# Altium schematic sheet MCU_F2.SchDoc
size A3
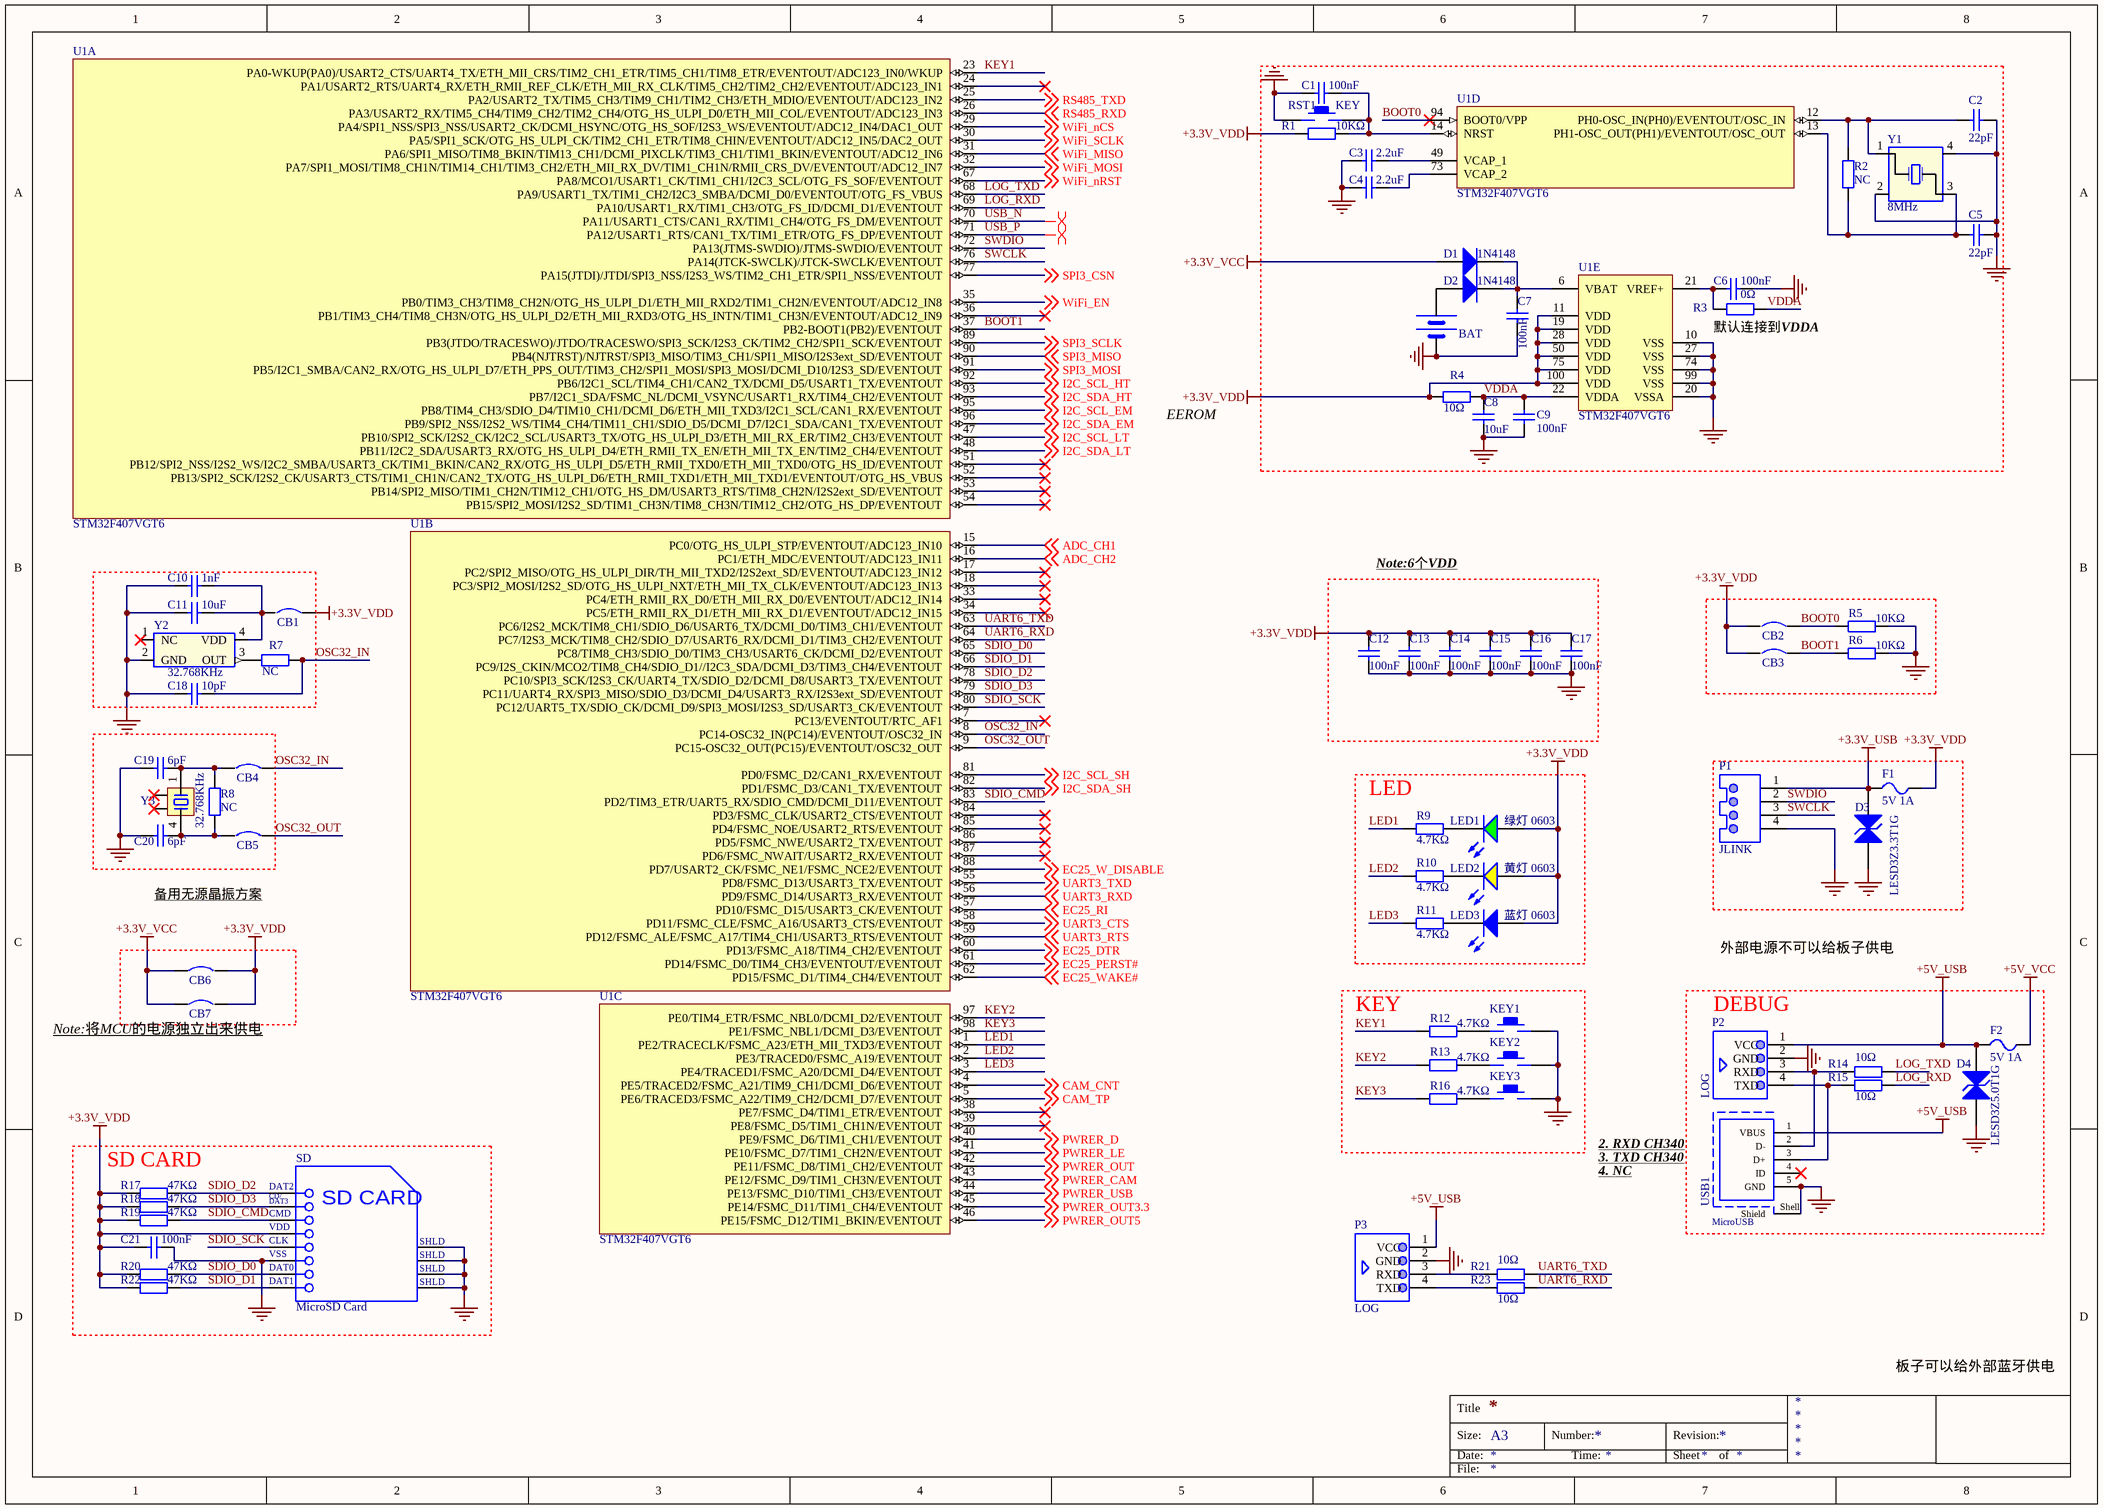
[diagram p0: MCU_F2.SchDoc]

## Parts
BAT  BAT CR1220  [CR1220_B]  (value not drawn)
C1  100nF  [0603_C]
C2  22pF  [0402_C]
C3  2.2uF  [0603_C]
C4  2.2uF  [0603_C]
C5  22pF  [0402_C]
C6  100nF  [0402_C]
C7  100nF  [0402_C]
C8  10uF  [0805_C]
C9  100nF  [0402_C]
C10  1nF  [0402_C]
C11  10uF  [0603_C]
C12  100nF  [0402_C]
C13  100nF  [0402_C]
C14  100nF  [0402_C]
C15  100nF  [0402_C]
C16  100nF  [0402_C]
C17  100nF  [0402_C]
C18  10pF  [0402_C]
C19  6pF  [0402_C]
C20  6pF  [0402_C]
C21  100nF  [0402_C]
CB1  CB  [CW]  (value not drawn)  (no BOM)
CB2  CB  [CW]  (value not drawn)  (no BOM)
CB3  CB  [CW]  (value not drawn)  (no BOM)
CB4  CB  [CW]  (value not drawn)  (no BOM)
CB5  CB  [CW]  (value not drawn)  (no BOM)
CB6  CB  [CW]  (value not drawn)  (no BOM)
CB7  CB  [CW]  (value not drawn)  (no BOM)
D1  1N4148  [SOD-323]
D2  1N4148  [SOD-323]
D3  LESD3Z3.3T1G  [SOD-323]
D4  LESD3Z5.0T1G  [SOD-323]
F1  5V 1A  [FU 0603]
F2  5V 1A  [FU 0603]
KEY1  KEY  [TSW SMD-6*6*5]  (value not drawn)
KEY2  KEY  [TSW SMD-6*6*5]  (value not drawn)
KEY3  KEY  [TSW SMD-6*6*5]  (value not drawn)
LED1  绿灯 0603  [0603_LED_S1]
LED2  黄灯 0603  [0603_LED_S1]
LED3  蓝灯 0603  [0603_LED_S1]
P1  JLINK  [XH2.54-4P]
P2  LOG  [HDR-4P UART]
P3  LOG  [HDR-4P UART]
R1  10KΩ  [0603_R]
R2  NC  [0402_R]
R3  0Ω  [0402_R]
R4  10Ω  [0402_R]
R5  10KΩ  [0402_R]
R6  10KΩ  [0402_R]
R7  NC  [0402_R]
R8  NC  [0402_R]
R9  4.7KΩ  [0603_R]
R10  4.7KΩ  [0603_R]
R11  4.7KΩ  [0603_R]
R12  4.7KΩ  [0603_R]
R13  4.7KΩ  [0603_R]
R14  10Ω  [0402_R]
R15  10Ω  [0402_R]
R16  4.7KΩ  [0603_R]
R17  47KΩ  [0402_R]
R18  47KΩ  [0402_R]
R19  47KΩ  [0402_R]
R20  47KΩ  [0402_R]
R21  10Ω  [0402_R]
R22  47KΩ  [0402_R]
R23  10Ω  [0402_R]
RST1  KEY  [TSW SMD-4*4*1.5]
SD  MicroSD Card  [MOLX-47219-2001-8_V]
U1  STM32F407VGT6  [STM-LQFP100_L]  (parts A,B,C,D,E of 5)
USB1  MicroUSB  [MOLX-47589-0001]
Y1  8MHz  [XTAL-5032-4P]
Y2  32.768KHz  [XTAL-3225-4P]
Y3  32.768KHz  [OSC MC-306]

## Blocks framed on the sheet
默认连接到VDDA: BAT C1-C9 D1 D2 R1-R4 RST1 U1 Y1
Note:6个VDD: C12-C17
LED: LED1-LED3 R9-R11
KEY: KEY1-KEY3 R12 R13 R16
DEBUG: D4 F2 P2 R14 R15 USB1
SD CARD: C21 R17-R20 R22 SD

## Nets
+3.3V_USB: D3.2(K) F1.1 P1.1
+3.3V_VCC: CB6.1 CB7.1 D1.1(A)
+3.3V_VDD: C12.1 C13.1 C14.1 C15.1 C16.1 C17.1 C21.1 CB1.2 CB2.1 CB3.1 CB6.2 CB7.2 F1.2 LED1.A LED2.A LED3.A R1.1 R4.1 R17.1 R18.1 R19.1 R20.1 R22.1 SD.4(VDD) U1.11(VDD) U1.19(VDD) U1.28(VDD) U1.50(VDD) U1.75(VDD) U1.100(VDD)
+5V_USB: D4.2(K) F2.1 P2.1(VCC) P3.1(VCC) USB1.1(VBUS)
+5V_VCC: F2.2
GND: BAT.2(GND) C1.1 C2.2 C3.1 C4.1 C5.2 C6.1 C7.2 C8.1 C9.1 C10.1 C11.1 C12.2 C13.2 C14.2 C15.2 C16.2 C17.2 C18.1 C19.2 C20.2 C21.2 D3.1(A) D4.1(A) KEY1.2 KEY2.2 KEY3.2 P1.4 P2.2(GND) P3.2(GND) R5.2 R6.2 RST1.1 SD.6(VSS) SD.9(SHLD) SD.10(SHLD) SD.11(SHLD) SD.12(SHLD) U1.10(VSS) U1.20(VSSA) U1.27(VSS) U1.74(VSS) U1.99(VSS) USB1.5(GND) USB1.Shell(Shield) Y1.2 Y1.4 Y2.2(GND)
ADC_CH1: U1.15(PC0/OTG_HS_ULPI_STP/EVENTOUT/ADC123_IN10) ; off-sheet ADC_CH1
ADC_CH2: U1.16(PC1/ETH_MDC/EVENTOUT/ADC123_IN11) ; off-sheet ADC_CH2
BOOT0: CB2.2 R5.1 U1.94(BOOT0/VPP)
BOOT1: CB3.2 R6.1 U1.37(PB2-BOOT1(PB2)/EVENTOUT)
CAM_CNT: U1.4(PE5/TRACED2/FSMC_A21/TIM9_CH1/DCMI_D6/EVENTOUT) ; off-sheet CAM_CNT
CAM_TP: U1.5(PE6/TRACED3/FSMC_A22/TIM9_CH2/DCMI_D7/EVENTOUT) ; off-sheet CAM_TP
EC25_DTR: U1.60(PD13/FSMC_A18/TIM4_CH2/EVENTOUT) ; off-sheet EC25_DTR
EC25_PERST#: U1.61(PD14/FSMC_D0/TIM4_CH3/EVENTOUT/EVENTOUT) ; off-sheet EC25_PERST#
EC25_RI: U1.57(PD10/FSMC_D15/USART3_CK/EVENTOUT) ; off-sheet EC25_RI
EC25_W_DISABLE: U1.88(PD7/USART2_CK/FSMC_NE1/FSMC_NCE2/EVENTOUT) ; off-sheet EC25_W_DISABLE
EC25_WAKE#: U1.62(PD15/FSMC_D1/TIM4_CH4/EVENTOUT) ; off-sheet EC25_WAKE#
I2C_SCL_EM: U1.95(PB8/TIM4_CH3/SDIO_D4/TIM10_CH1/DCMI_D6/ETH_MII_TXD3/I2C1_SCL/CAN1_RX/EVENTOUT) ; off-sheet I2C_SCL_EM
I2C_SCL_HT: U1.92(PB6/I2C1_SCL/TIM4_CH1/CAN2_TX/DCMI_D5/USART1_TX/EVENTOUT) ; off-sheet I2C_SCL_HT
I2C_SCL_LT: U1.47(PB10/SPI2_SCK/I2S2_CK/I2C2_SCL/USART3_TX/OTG_HS_ULPI_D3/ETH_MII_RX_ER/TIM2_CH3/EVENTOUT) ; off-sheet I2C_SCL_LT
I2C_SCL_SH: U1.81(PD0/FSMC_D2/CAN1_RX/EVENTOUT) ; off-sheet I2C_SCL_SH
I2C_SDA_EM: U1.96(PB9/SPI2_NSS/I2S2_WS/TIM4_CH4/TIM11_CH1/SDIO_D5/DCMI_D7/I2C1_SDA/CAN1_TX/EVENTOUT) ; off-sheet I2C_SDA_EM
I2C_SDA_HT: U1.93(PB7/I2C1_SDA/FSMC_NL/DCMI_VSYNC/USART1_RX/TIM4_CH2/EVENTOUT) ; off-sheet I2C_SDA_HT
I2C_SDA_LT: U1.48(PB11/I2C2_SDA/USART3_RX/OTG_HS_ULPI_D4/ETH_RMII_TX_EN/ETH_MII_TX_EN/TIM2_CH4/EVENTOUT) ; off-sheet I2C_SDA_LT
I2C_SDA_SH: U1.82(PD1/FSMC_D3/CAN1_TX/EVENTOUT) ; off-sheet I2C_SDA_SH
KEY1: R12.1 U1.23(PA0-WKUP(PA0)/USART2_CTS/UART4_TX/ETH_MII_CRS/TIM2_CH1_ETR/TIM5_CH1/TIM8_ETR/EVENTOUT/ADC123_IN0/WKUP)
KEY2: R13.1 U1.97(PE0/TIM4_ETR/FSMC_NBL0/DCMI_D2/EVENTOUT)
KEY3: R16.1 U1.98(PE1/FSMC_NBL1/DCMI_D3/EVENTOUT)
LED1: R9.1 U1.1(PE2/TRACECLK/FSMC_A23/ETH_MII_TXD3/EVENTOUT)
LED2: R10.1 U1.2(PE3/TRACED0/FSMC_A19/EVENTOUT)
LED3: R11.1 U1.3(PE4/TRACED1/FSMC_A20/DCMI_D4/EVENTOUT)
LOG_RXD: R15.2 U1.69(PA10/USART1_RX/TIM1_CH3/OTG_FS_ID/DCMI_D1/EVENTOUT)
LOG_TXD: R14.2 U1.68(PA9/USART1_TX/TIM1_CH2/I2C3_SMBA/DCMI_D0/EVENTOUT/OTG_FS_VBUS)
OSC32_IN: C18.2 CB4.2 R7.2 U1.8(PC14-OSC32_IN(PC14)/EVENTOUT/OSC32_IN)
OSC32_OUT: CB5.2 U1.9(PC15-OSC32_OUT(PC15)/EVENTOUT/OSC32_OUT)
PWRER_CAM: U1.43(PE12/FSMC_D9/TIM1_CH3N/EVENTOUT) ; off-sheet PWRER_CAM
PWRER_D: U1.40(PE9/FSMC_D6/TIM1_CH1/EVENTOUT) ; off-sheet PWRER_D
PWRER_LE: U1.41(PE10/FSMC_D7/TIM1_CH2N/EVENTOUT) ; off-sheet PWRER_LE
PWRER_OUT: U1.42(PE11/FSMC_D8/TIM1_CH2/EVENTOUT) ; off-sheet PWRER_OUT
PWRER_OUT3.3: U1.45(PE14/FSMC_D11/TIM1_CH4/EVENTOUT) ; off-sheet PWRER_OUT3.3
PWRER_OUT5: U1.46(PE15/FSMC_D12/TIM1_BKIN/EVENTOUT) ; off-sheet PWRER_OUT5
PWRER_USB: U1.44(PE13/FSMC_D10/TIM1_CH3/EVENTOUT) ; off-sheet PWRER_USB
RS485_RXD: U1.26(PA3/USART2_RX/TIM5_CH4/TIM9_CH2/TIM2_CH4/OTG_HS_ULPI_D0/ETH_MII_COL/EVENTOUT/ADC123_IN3) ; off-sheet RS485_RXD
RS485_TXD: U1.25(PA2/USART2_TX/TIM5_CH3/TIM9_CH1/TIM2_CH3/ETH_MDIO/EVENTOUT/ADC123_IN2) ; off-sheet RS485_TXD
SDIO_CMD: R19.2 SD.3(CMD) U1.83(PD2/TIM3_ETR/UART5_RX/SDIO_CMD/DCMI_D11/EVENTOUT)
SDIO_D0: R20.2 SD.7(DAT0) U1.65(PC8/TIM8_CH3/SDIO_D0/TIM3_CH3/USART6_CK/DCMI_D2/EVENTOUT)
SDIO_D1: R22.2 SD.8(DAT1) U1.66(PC9/I2S_CKIN/MCO2/TIM8_CH4/SDIO_D1//I2C3_SDA/DCMI_D3/TIM3_CH4/EVENTOUT)
SDIO_D2: R17.2 SD.1(DAT2) U1.78(PC10/SPI3_SCK/I2S3_CK/UART4_TX/SDIO_D2/DCMI_D8/USART3_TX/EVENTOUT)
SDIO_D3: R18.2 SD.2(CD/DAT3) U1.79(PC11/UART4_RX/SPI3_MISO/SDIO_D3/DCMI_D4/USART3_RX/I2S3ext_SD/EVENTOUT)
SDIO_SCK: SD.5(CLK) U1.80(PC12/UART5_TX/SDIO_CK/DCMI_D9/SPI3_MOSI/I2S3_SD/USART3_CK/EVENTOUT)
SPI3_CSN: U1.77(PA15(JTDI)/JTDI/SPI3_NSS/I2S3_WS/TIM2_CH1_ETR/SPI1_NSS/EVENTOUT) ; off-sheet SPI3_CSN
SPI3_MISO: U1.90(PB4(NJTRST)/NJTRST/SPI3_MISO/TIM3_CH1/SPI1_MISO/I2S3ext_SD/EVENTOUT) ; off-sheet SPI3_MISO
SPI3_MOSI: U1.91(PB5/I2C1_SMBA/CAN2_RX/OTG_HS_ULPI_D7/ETH_PPS_OUT/TIM3_CH2/SPI1_MOSI/SPI3_MOSI/DCMI_D10/I2S3_SD/EVENTOUT) ; off-sheet SPI3_MOSI
SPI3_SCLK: U1.89(PB3(JTDO/TRACESWO)/JTDO/TRACESWO/SPI3_SCK/I2S3_CK/TIM2_CH2/SPI1_SCK/EVENTOUT) ; off-sheet SPI3_SCLK
SWCLK: P1.3 U1.76(PA14(JTCK-SWCLK)/JTCK-SWCLK/EVENTOUT)
SWDIO: P1.2 U1.72(PA13(JTMS-SWDIO)/JTMS-SWDIO/EVENTOUT)
UART3_CTS: U1.58(PD11/FSMC_CLE/FSMC_A16/USART3_CTS/EVENTOUT) ; off-sheet UART3_CTS
UART3_RTS: U1.59(PD12/FSMC_ALE/FSMC_A17/TIM4_CH1/USART3_RTS/EVENTOUT) ; off-sheet UART3_RTS
UART3_RXD: U1.56(PD9/FSMC_D14/USART3_RX/EVENTOUT) ; off-sheet UART3_RXD
UART3_TXD: U1.55(PD8/FSMC_D13/USART3_TX/EVENTOUT) ; off-sheet UART3_TXD
UART6_RXD: R23.2 U1.64(PC7/I2S3_MCK/TIM8_CH2/SDIO_D7/USART6_RX/DCMI_D1/TIM3_CH2/EVENTOUT)
UART6_TXD: R21.2 U1.63(PC6/I2S2_MCK/TIM8_CH1/SDIO_D6/USART6_TX/DCMI_D0/TIM3_CH1/EVENTOUT)
USB_N: U1.70(PA11/USART1_CTS/CAN1_RX/TIM1_CH4/OTG_FS_DM/EVENTOUT)
USB_P: U1.71(PA12/USART1_RTS/CAN1_TX/TIM1_ETR/OTG_FS_DP/EVENTOUT)
VDDA: C8.2 C9.2 R3.2 R4.2 U1.22(VDDA)
WiFi_EN: U1.35(PB0/TIM3_CH3/TIM8_CH2N/OTG_HS_ULPI_D1/ETH_MII_RXD2/TIM1_CH2N/EVENTOUT/ADC12_IN8) ; off-sheet WiFi_EN
WiFi_MISO: U1.31(PA6/SPI1_MISO/TIM8_BKIN/TIM13_CH1/DCMI_PIXCLK/TIM3_CH1/TIM1_BKIN/EVENTOUT/ADC12_IN6) ; off-sheet WiFi_MISO
WiFi_MOSI: U1.32(PA7/SPI1_MOSI/TIM8_CH1N/TIM14_CH1/TIM3_CH2/ETH_MII_RX_DV/TIM1_CH1N/RMII_CRS_DV/EVENTOUT/ADC12_IN7) ; off-sheet WiFi_MOSI
WiFi_nCS: U1.29(PA4/SPI1_NSS/SPI3_NSS/USART2_CK/DCMI_HSYNC/OTG_HS_SOF/I2S3_WS/EVENTOUT/ADC12_IN4/DAC1_OUT) ; off-sheet WiFi_nCS
WiFi_nRST: U1.67(PA8/MCO1/USART1_CK/TIM1_CH1/I2C3_SCL/OTG_FS_SOF/EVENTOUT) ; off-sheet WiFi_nRST
WiFi_SCLK: U1.30(PA5/SPI1_SCK/OTG_HS_ULPI_CK/TIM2_CH1_ETR/TIM8_CHIN/EVENTOUT/ADC12_IN5/DAC2_OUT) ; off-sheet WiFi_SCLK
NetBAT_1: BAT.1(VCC) D2.1(A)
NetC1_2: C1.2 R1.2 RST1.2 U1.14(NRST)
NetC2_1: C2.1 R2.2 U1.12(PH0-OSC_IN(PH0)/EVENTOUT/OSC_IN) Y1.1
NetC3_2: C3.2 U1.49(VCAP_1)
NetC4_2: C4.2 U1.73(VCAP_2)
NetC5_1: C5.1 R2.1 U1.13(PH1-OSC_OUT(PH1)/EVENTOUT/OSC_OUT) Y1.3
NetC6_2: C6.2 R3.1 U1.21(VREF+)
NetC7_1: C7.1 D1.2(K) D2.2(K) U1.6(VBAT)
NetC10_2: C10.2 C11.2 CB1.1 Y2.4(VDD)
NetC19_1: C19.1 CB4.1 R8.1 Y3.1
NetC20_1: C20.1 CB5.1 R8.2 Y3.4
NetKEY1_1: KEY1.1 R12.2
NetKEY2_1: KEY2.1 R13.2
NetKEY3_1: KEY3.1 R16.2
NetLED1_K: LED1.K R9.2
NetLED2_K: LED2.K R10.2
NetLED3_K: LED3.K R11.2
NetP2_3: P2.3(RXD) R14.1 USB1.2(D-)
NetP2_4: P2.4(TXD) R15.1 USB1.3(D+)
NetP3_3: P3.3(RXD) R21.1
NetP3_4: P3.4(TXD) R23.1
NetR7_1: R7.1 Y2.3(OUT)

Not connected (* = marked no-connect by the designer): U1 7(PC13/EVENTOUT/RTC_AF1)* 17(PC2/SPI2_MISO/OTG_HS_ULPI_DIR/TH_MII_TXD2/I2S2ext_SD/EVENTOUT/ADC123_IN12)* 18(PC3/SPI2_MOSI/I2S2_SD/OTG_HS_ULPI_NXT/ETH_MII_TX_CLK/EVENTOUT/ADC123_IN13)* 24(PA1/USART2_RTS/UART4_RX/ETH_RMII_REF_CLK/ETH_MII_RX_CLK/TIM5_CH2/TIM2_CH2/EVENTOUT/ADC123_IN1)* 33(PC4/ETH_RMII_RX_D0/ETH_MII_RX_D0/EVENTOUT/ADC12_IN14)* 34(PC5/ETH_RMII_RX_D1/ETH_MII_RX_D1/EVENTOUT/ADC12_IN15)* 36(PB1/TIM3_CH4/TIM8_CH3N/OTG_HS_ULPI_D2/ETH_MII_RXD3/OTG_HS_INTN/TIM1_CH3N/EVENTOUT/ADC12_IN9)* 38(PE7/FSMC_D4/TIM1_ETR/EVENTOUT)* 39(PE8/FSMC_D5/TIM1_CH1N/EVENTOUT)* 51(PB12/SPI2_NSS/I2S2_WS/I2C2_SMBA/USART3_CK/TIM1_BKIN/CAN2_RX/OTG_HS_ULPI_D5/ETH_RMII_TXD0/ETH_MII_TXD0/OTG_HS_ID/EVENTOUT)* 52(PB13/SPI2_SCK/I2S2_CK/USART3_CTS/TIM1_CH1N/CAN2_TX/OTG_HS_ULPI_D6/ETH_RMII_TXD1/ETH_MII_TXD1/EVENTOUT/OTG_HS_VBUS)* 53(PB14/SPI2_MISO/TIM1_CH2N/TIM12_CH1/OTG_HS_DM/USART3_RTS/TIM8_CH2N/I2S2ext_SD/EVENTOUT)* 54(PB15/SPI2_MOSI/I2S2_SD/TIM1_CH3N/TIM8_CH3N/TIM12_CH2/OTG_HS_DP/EVENTOUT)* 84(PD3/FSMC_CLK/USART2_CTS/EVENTOUT)* 85(PD4/FSMC_NOE/USART2_RTS/EVENTOUT)* 86(PD5/FSMC_NWE/USART2_TX/EVENTOUT)* 87(PD6/FSMC_NWAIT/USART2_RX/EVENTOUT)*; USB1 4(ID)*; Y2 1(NC)*; Y3 2* 3*

## Layout directives
differential pair: USB_N, USB_P

## Notes on the sheet
- EEROM
- 备用无源晶振方案
- 外部电源不可以给板子供电
- (near CB7) Note:将MCU的电源独立出来供电
- 2. RXD CH340
- 3. TXD CH340
- 4. NC
- 板子可以给外部蓝牙供电
- Title
- Size:
- Date:
- A3
- Number:
- Time:
- Revision:
- Sheet
- of
- File:
- *
- (in symbol MicroSD_Card) CD/; DAT3; SD CARD

## Library data of the parts
C1 = Cap 0603 100nF (104) 10% 50V: 贴片电容; ComponentLink1Description: 供应商链接; ComponentLink1URL: http://www.szlcsc.com/product/details_15331.html; Package: 0603; Supplier: LC; SuppliersPartNumber: C14663
C2 C5 = Cap 0402 22pF (220) 5% 50V: 贴片电容; ComponentLink1Description: 供应商链接; ComponentLink1URL: http://www.szlcsc.com/product/details_1907.html; Package: 0402; Supplier: LC; SuppliersPartNumber: C1555
C3 C4 = Cap 0603 2.2uF (225) 10% 16V: 贴片电容; ComponentLink1Description: 供应商链接; ComponentLink1URL: http://www.szlcsc.com/product/details_24366.html; Package: 0603; Supplier: LC; SuppliersPartNumber: C23630
C6 C7 C9 C12-C17 C21 = Cap 0402 100nF (104) 10% 16V: 贴片电容; ComponentLink1Description: 供应商链接; ComponentLink1URL: http://www.szlcsc.com/product/details_1877.html; Package: 0402; Supplier: LC; SuppliersPartNumber: C1525
  C12: Value: 100nF
C8 = Cap 0805 10uF (106) 10% 25V: 贴片电容; ComponentLink1Description: 供应商链接; ComponentLink1URL: http://www.szlcsc.com/product/details_16532.html; Package: 0805; Supplier: LC; SuppliersPartNumber: C15850; Value: 10uF
C10 = Cap 0402 1nF (102) 10% 50V: 贴片电容; ComponentLink1Description: 供应商链接; ComponentLink1URL: http://www.szlcsc.com/product/details_1875.html; Package: 0402; Supplier: LC; SuppliersPartNumber: C1523; Value: 1nF
C11 = Cap 0603 10uF (106) 10% 10V: 贴片电容; ComponentLink1Description: 供应商链接; ComponentLink1URL: http://www.szlcsc.com/product/details_20411.html; Package: 0603; Supplier: LC; SuppliersPartNumber: C19702
C18 = Cap 0402 10pF (100) 5% 50V: 贴片电容; ComponentLink1Description: 供应商链接; ComponentLink1URL: http://www.szlcsc.com/product/details_33914.html; Package: 0402; Supplier: LC; SuppliersPartNumber: C32949
C19 C20 = Cap 0402 6pF (6R0) 0.25pF 50V: 贴片电容; ComponentLink1Description: 供应商链接; ComponentLink1URL: http://www.szlcsc.com/product/details_31031.html; Package: 0402; Supplier: LC; SuppliersPartNumber: C30274
CB1-CB7 = Circuit Breaker: Published: 24-Mar-1999; LatestRevisionDate: 17-Jul-2002; LatestRevisionNote: Re-released for DXP Platform.; PackageReference: SPST-2; Publisher: Altium Limited
D1 D2 = DIO SOD-323 1N4148WS T4: 二极管; ComponentLink1Description: 供应商链接; ComponentLink1URL: http://www.szlcsc.com/product/details_2485.html; Package: SOD-323; Supplier: LC; SuppliersPartNumber: C2128
D3 = SOD-323 LESD3Z3.3T1G: TVS/ESD, SOD-323, 3.3V; ComponentLink1Description: 供应商链接; ComponentLink1URL: http://www.szlcsc.com/product/details_79530.html; Package: SMB/DO-214AA; Supplier: LC; SuppliersPartNumber: C78395
D4 = SOD-323 LESD3Z5.0T1G: TVS/ESD, SOD-323, 5V; ComponentLink1Description: 供应商链接; ComponentLink1URL: http://www.szlcsc.com/product/details_79530.html; Package: SMB/DO-214AA; Supplier: LC; SuppliersPartNumber: C78395
F1 F2 = FU PPTC MSMD 5V 1A: 自恢复保险丝; BOM名称: 贴片保险丝; 版权归属: 源创客; 学习资源: www.ooocke.com
KEY1-KEY3 = KEY_M
LED1 = LED 0603 绿灯: 发光二极管; ComponentLink1Description: 供应商链接; ComponentLink1URL: http://www.szlcsc.com/product/details_73152.html; Package: 0603; Supplier: LC; SuppliersPartNumber: C72043
LED2 = LED 0603 黄灯: 发光二极管; ComponentLink1Description: 供应商链接; ComponentLink1URL: http://www.szlcsc.com/product/details_73147.html; Package: 0603; Supplier: LC; SuppliersPartNumber: C72038
LED3 = LED 0603 蓝灯: 发光二极管; ComponentLink1Description: 供应商链接; ComponentLink1URL: http://www.szlcsc.com/product/details_73150.html; Package: 0603; Supplier: LC; SuppliersPartNumber: C72041
P1 = Header XH-2.56-4P: Male Header, Pitch 2.5 mm, 1 x 4 Position, Height 7 mm, Tail Length 8.4 mm, -25 to 85 degC, RoHS, Bulk; Manufacturer: JST; No of Positions: 2; Pitch: 2.5mm; Style/Orientation: StraightHeader/Plug; Datasheet Version: 05/2016; Package Description: Male Header, Pitch 2.5 mm, 1 x 2 Position, Height 7 mm, Tail Length 3.4 mm; Package Reference: B2B-XH-A; Mounting Technology: ThroughHole; Type: ShroudedHeader; Datasheet URL: http://www.jst-mfg.com/product/pdf/eng/eXH.pdf; Manufacturer URL: http://www.jst.com/home2.html; Termination: Crimp
P2 P3 = HAR-4P UART: Header, 4-Pin; LatestRevisionDate: 17-Jul-2002; LatestRevisionNote: Re-released for DXP Platform.; Publisher: Altium Limited
R1 = Res 0603 10KΩ (1002) 1%: 贴片电阻; ComponentLink1Description: 供应商链接; ComponentLink1URL: http://www.szlcsc.com/product/details_26547.html; Package: 0603; Supplier: LC; SuppliersPartNumber: C25804
R2 R8 = Res 0402 1MΩ (1004) 1%: 贴片电阻; Value: 1MΩ; ComponentLink1Description: 供应商链接; ComponentLink1URL: http://www.szlcsc.com/product/details_26826.html; Package: 0402; Supplier: LC; SuppliersPartNumber: C26083
R3 = Res 0402 0Ω (0R0) 1%: 贴片电阻; ComponentLink1Description: 供应商链接; ComponentLink1URL: http://www.szlcsc.com/product/details_17853.html; Package: 0402; Supplier: LC; SuppliersPartNumber: C17168; Value: 0Ω
R4 R7 R14 R15 R21 R23 = Res 0402 10Ω (10R0) 1%: 贴片电阻; ComponentLink1Description: 供应商链接; ComponentLink1URL: http://www.szlcsc.com/product/details_25820.html; Package: 0402; Supplier: LC; SuppliersPartNumber: C25077
R5 R6 = Res 0402 10KΩ (1002) 1%: 贴片电阻; ComponentLink1Description: 供应商链接; ComponentLink1URL: http://www.szlcsc.com/product/details_26487.html; Package: 0402; Supplier: LC; SuppliersPartNumber: C25744; Value: 10KΩ
R9-R13 R16 = Res 0603 4.7KΩ (4701) 1%: 贴片电阻; ComponentLink1Description: 供应商链接; ComponentLink1URL: http://www.szlcsc.com/product/details_23889.html; Package: 0603; Supplier: LC; SuppliersPartNumber: C23162
R17-R20 R22 = Res 0402 47KΩ (4702) 1%: 贴片电阻; ComponentLink1Description: 供应商链接; ComponentLink1URL: http://www.szlcsc.com/product/details_26535.html; Package: 0402; Supplier: LC; SuppliersPartNumber: C25792
RST1 = KEY_TWS
SD = MicroSD_Card: MicroSD Card Connector, Hinge Type, -40 to 85 degC, 8-Pin SMD, RoHS, Tape and Reel, CMP-2000-05245-1; Manufacturer: Molex; Current Rating: 500mA; Number of Contacts: 8; Pitch: 1.09mm; Insertion - Extraction Style: Hinged; Voltage Rating: 100VDC; Product: CardConnectors; Contact Material: CopperAlloy; Series: 47219; Packaging: Reel; Brand: Molex; Product Category: MemoryCardConnectors; Housing Material: Thermoplastic; Mounting Style: SMD/SMT; Termination Style: SMD; Datasheet Version: Rev. F, 06/2009; Card Type: microSD; Manufacturer URL: http://www.molex.com/; RoHS: Details; Datasheet URL: http://www.molex.com/pdm_docs/sd/472192001_sd.pdf; Factory Pack Quantity: 2400
U1 = STM32F407VGT6: ARM; ComponentLink1Description: 供应商链接; ComponentLink1URL: http://www.szlcsc.com/product/details_12968.html; Package: LQFP-100_14x14x05P; Supplier: LC; SuppliersPartNumber: C12345
USB1 = MicroUSB MOLX-47589-0001: Right Angle Female Type AB Micro USB Connector, 30 V, 1.8 A, -30 to 85 degC, RoHS, Tape and Reel; Part Number: 629105150921; Manufacturer: Wurth Elektronik; Rated Current: 1.8A; Contact Resistance: 30mOhm; Gender: Receptacle; Working Voltage: 30VAC; Connector Type: MicroUSB2.0TypeAB; Publisher: WurthElektronik; Operating Temperature: -40to85degC; Packaging: TapeandReel; Datasheet URL: https://katalog.we-online.de/em/datasheet/629105150921.pdf; Mounting Technology: SMT; Orientation: Horizontal; Package Reference: 629105150921; Manufacturer URL: http://www.we-online.de
Y1 = XTAL SMD-5032_4P 8MHz 10ppm 20pF: 贴片晶振; 402F40012IKR; 8MHz 10ppm 20pF -40C +85C; CLASS: IC
Y2 = XTAL SMD-3225 32.768KHz: 有源贴片晶振; CLASS: IC
Y3 = XTAL-MC306: 4脚晶振; 版权归属: 源创客; BOM名称: 4脚晶振; 学习资源: www.ooocke.com